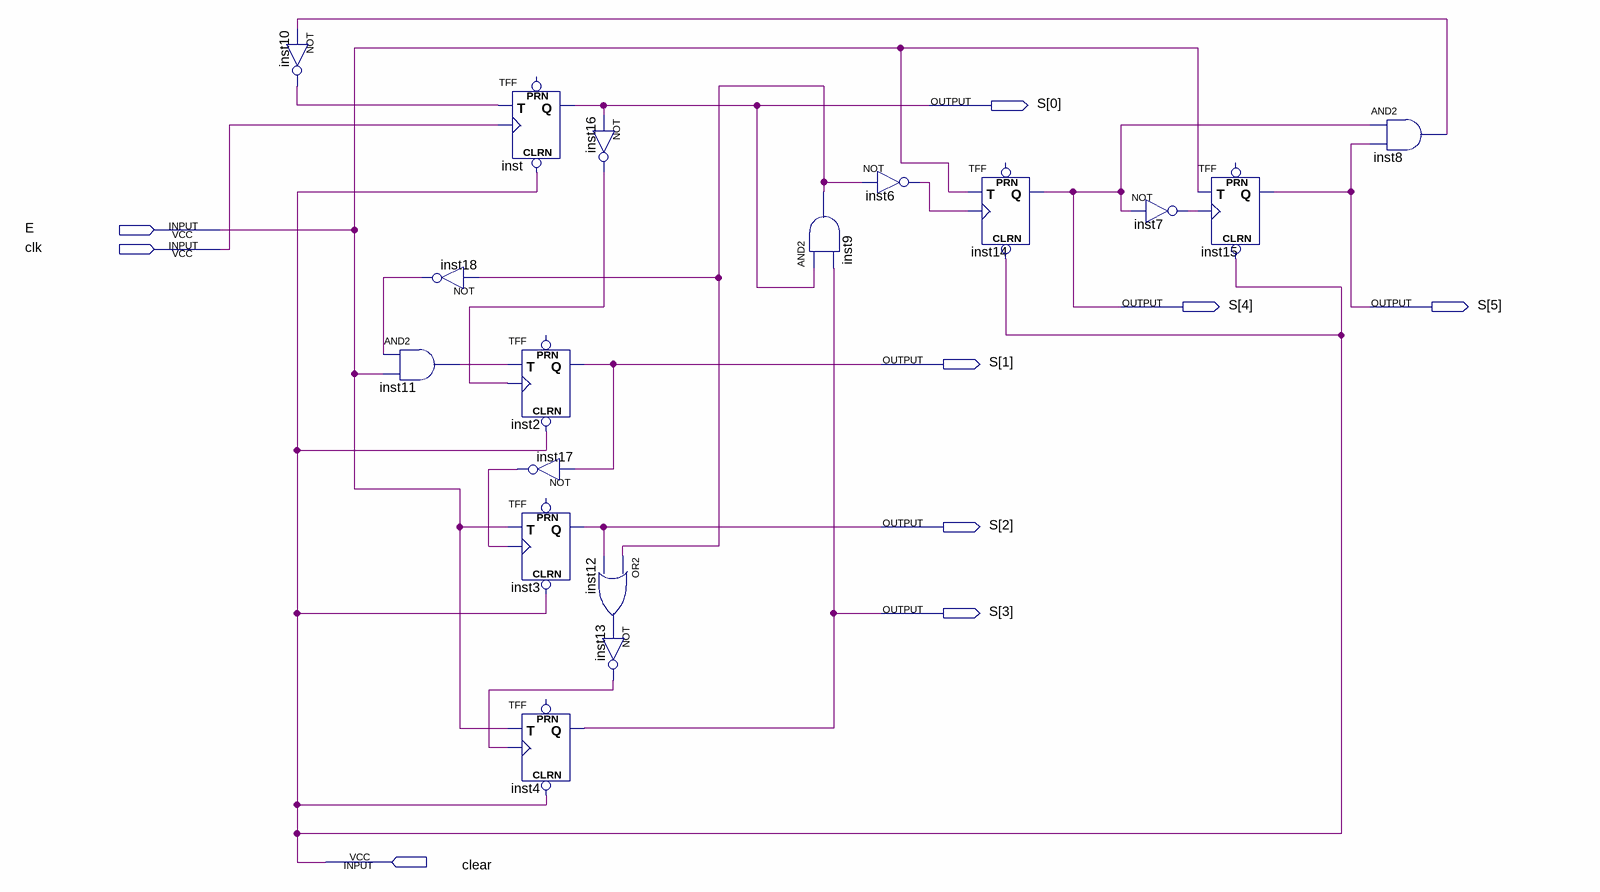
[diagram p0: schematic sheet]
// Quartus schematic HW07_2_t.bdf as structural Verilog: 17 symbols, 9 pins
module HW07_2_t (
  input  E,
  input  clk,
  input  clear,
  output [5:0] S
);

  wire inst6_out, inst7_out, inst8_out, inst9_out, inst10_out, inst11_out, inst12_out, inst13_out,
       inst16_out, inst17_out, inst18_out;

  not inst10 (inst10_out, inst8_out);
  not inst18 (inst18_out, inst9_out);
  and inst11 (inst11_out, inst18_out, E);
  TFF inst (.CLRN(clear), .T(inst10_out), .CLK(clk), .Q(S[0]));  // open: PRN
  TFF inst2 (.CLRN(clear), .T(inst11_out), .CLK(inst16_out), .Q(S[1]));  // open: PRN
  TFF inst3 (.CLRN(clear), .T(E), .CLK(inst17_out), .Q(S[2]));  // open: PRN
  TFF inst4 (.CLRN(clear), .T(E), .CLK(inst13_out), .Q(S[3]));  // open: PRN
  not inst16 (inst16_out, S[0]);
  not inst17 (inst17_out, S[1]);
  or inst12 (inst12_out, inst9_out, S[2]);
  not inst13 (inst13_out, inst12_out);
  and inst9 (inst9_out, S[0], S[3]);
  not inst6 (inst6_out, inst9_out);
  TFF inst14 (.CLRN(clear), .T(E), .CLK(inst6_out), .Q(S[4]));  // open: PRN
  TFF inst15 (.CLRN(clear), .T(E), .CLK(inst7_out), .Q(S[5]));  // open: PRN
  not inst7 (inst7_out, S[4]);
  and inst8 (inst8_out, S[4], S[5]);
endmodule
